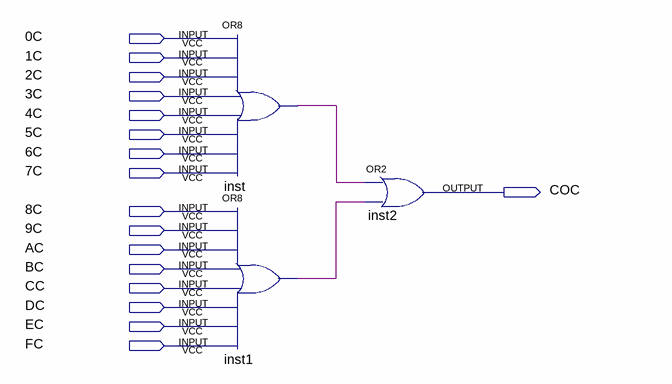
[diagram p0: schematic sheet]
// Quartus schematic COLUNA_C.bdf as structural Verilog: 3 symbols, 17 pins
module COLUNA_C (
  input  \0C ,
  input  \1C ,
  input  \2C ,
  input  \3C ,
  input  \4C ,
  input  \5C ,
  input  \6C ,
  input  \7C ,
  input  \8C ,
  input  \9C ,
  input  AC,
  input  BC,
  input  CC,
  input  DC,
  input  EC,
  input  FC,
  output COC
);

  wire inst1_out, inst_out;

  or inst (inst_out, \0C , \1C , \2C , \3C , \4C , \5C , \6C , \7C );
  or inst1 (inst1_out, \8C , \9C , AC, BC, CC, DC, EC, FC);
  or inst2 (COC, inst_out, inst1_out);
endmodule
